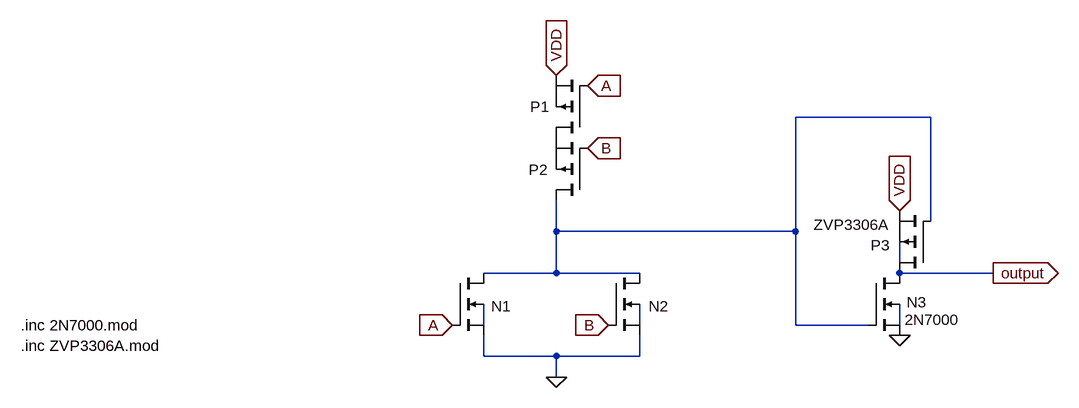
[diagram p0: schematic OR.asc]
OR.asc, the LTspice schematic file:
Version 4.1
SHEET 1 1624 680
WIRE 1392 -16 1184 -16
WIRE 1392 144 1392 -16
WIRE 816 160 816 112
WIRE 1184 160 1184 -16
WIRE 1184 160 816 160
WIRE 1344 208 1344 176
WIRE 816 224 816 160
WIRE 816 224 704 224
WIRE 944 224 816 224
WIRE 1488 224 1344 224
WIRE 704 304 704 272
WIRE 944 304 944 272
WIRE 1184 304 1184 160
WIRE 1296 304 1184 304
WIRE 1344 304 1344 272
WIRE 704 352 704 320
WIRE 816 352 704 352
WIRE 944 352 944 320
WIRE 944 352 816 352
WIRE 816 384 816 352
FLAG 816 384 0
FLAG 816 -80 VDD
IOPIN 816 -80 In
FLAG 864 -64 A
IOPIN 864 -64 In
FLAG 656 304 A
IOPIN 656 304 In
FLAG 864 32 B
IOPIN 864 32 In
FLAG 896 304 B
IOPIN 896 304 In
FLAG 1344 320 0
FLAG 1488 224 output
IOPIN 1488 224 Out
FLAG 1344 128 VDD
IOPIN 1344 128 In
SYMBOL nmos4 656 224 R0
WINDOW 0 60 51 Left 2
WINDOW 3 56 72 Invisible 2
SYMATTR InstName N1
SYMATTR Value 2N7000
SYMATTR Prefix X
SYMBOL pmos 864 16 R180
WINDOW 0 59 48 Left 2
WINDOW 3 56 72 Invisible 2
SYMATTR InstName P1
SYMATTR Value ZVP3306A
SYMATTR Prefix X
SYMBOL nmos4 896 224 R0
WINDOW 0 62 51 Left 2
WINDOW 3 56 72 Invisible 2
SYMATTR InstName N2
SYMATTR Value 2N7000
SYMATTR Prefix X
SYMBOL pmos 864 112 R180
WINDOW 0 61 47 Left 2
WINDOW 3 56 72 Invisible 2
SYMATTR InstName P2
SYMATTR Value ZVP3306A
SYMATTR Prefix X
SYMBOL nmos4 1296 224 R0
WINDOW 0 59 45 Left 2
SYMATTR InstName N3
SYMATTR Value 2N7000
SYMATTR Prefix X
SYMBOL pmos 1392 224 R180
WINDOW 0 63 43 Left 2
WINDOW 3 64 74 Left 2
SYMATTR InstName P3
SYMATTR Value ZVP3306A
SYMATTR Prefix X
TEXT -8 304 Left 2 !.inc 2N7000.mod
TEXT -8 336 Left 2 !.inc ZVP3306A.mod

The netlist it stands for:
* OR.asc
X§N1 N001 A 0 N003 2N7000  ; pins D G S B
X§P1 P001 A VDD ZVP3306A  ; pins D G S
X§N2 N001 B 0 N004 2N7000  ; pins D G S B
X§P2 N001 B P001 ZVP3306A  ; pins D G S
X§N3 output N001 0 N005 2N7000  ; pins D G S B
X§P3 output N001 VDD ZVP3306A  ; pins D G S
.inc 2N7000.mod
.inc ZVP3306A.mod
.backanno
.end